# EAGLE design IMU-Measurement-and-Transmission-Module (EAGLE 9.6.2)
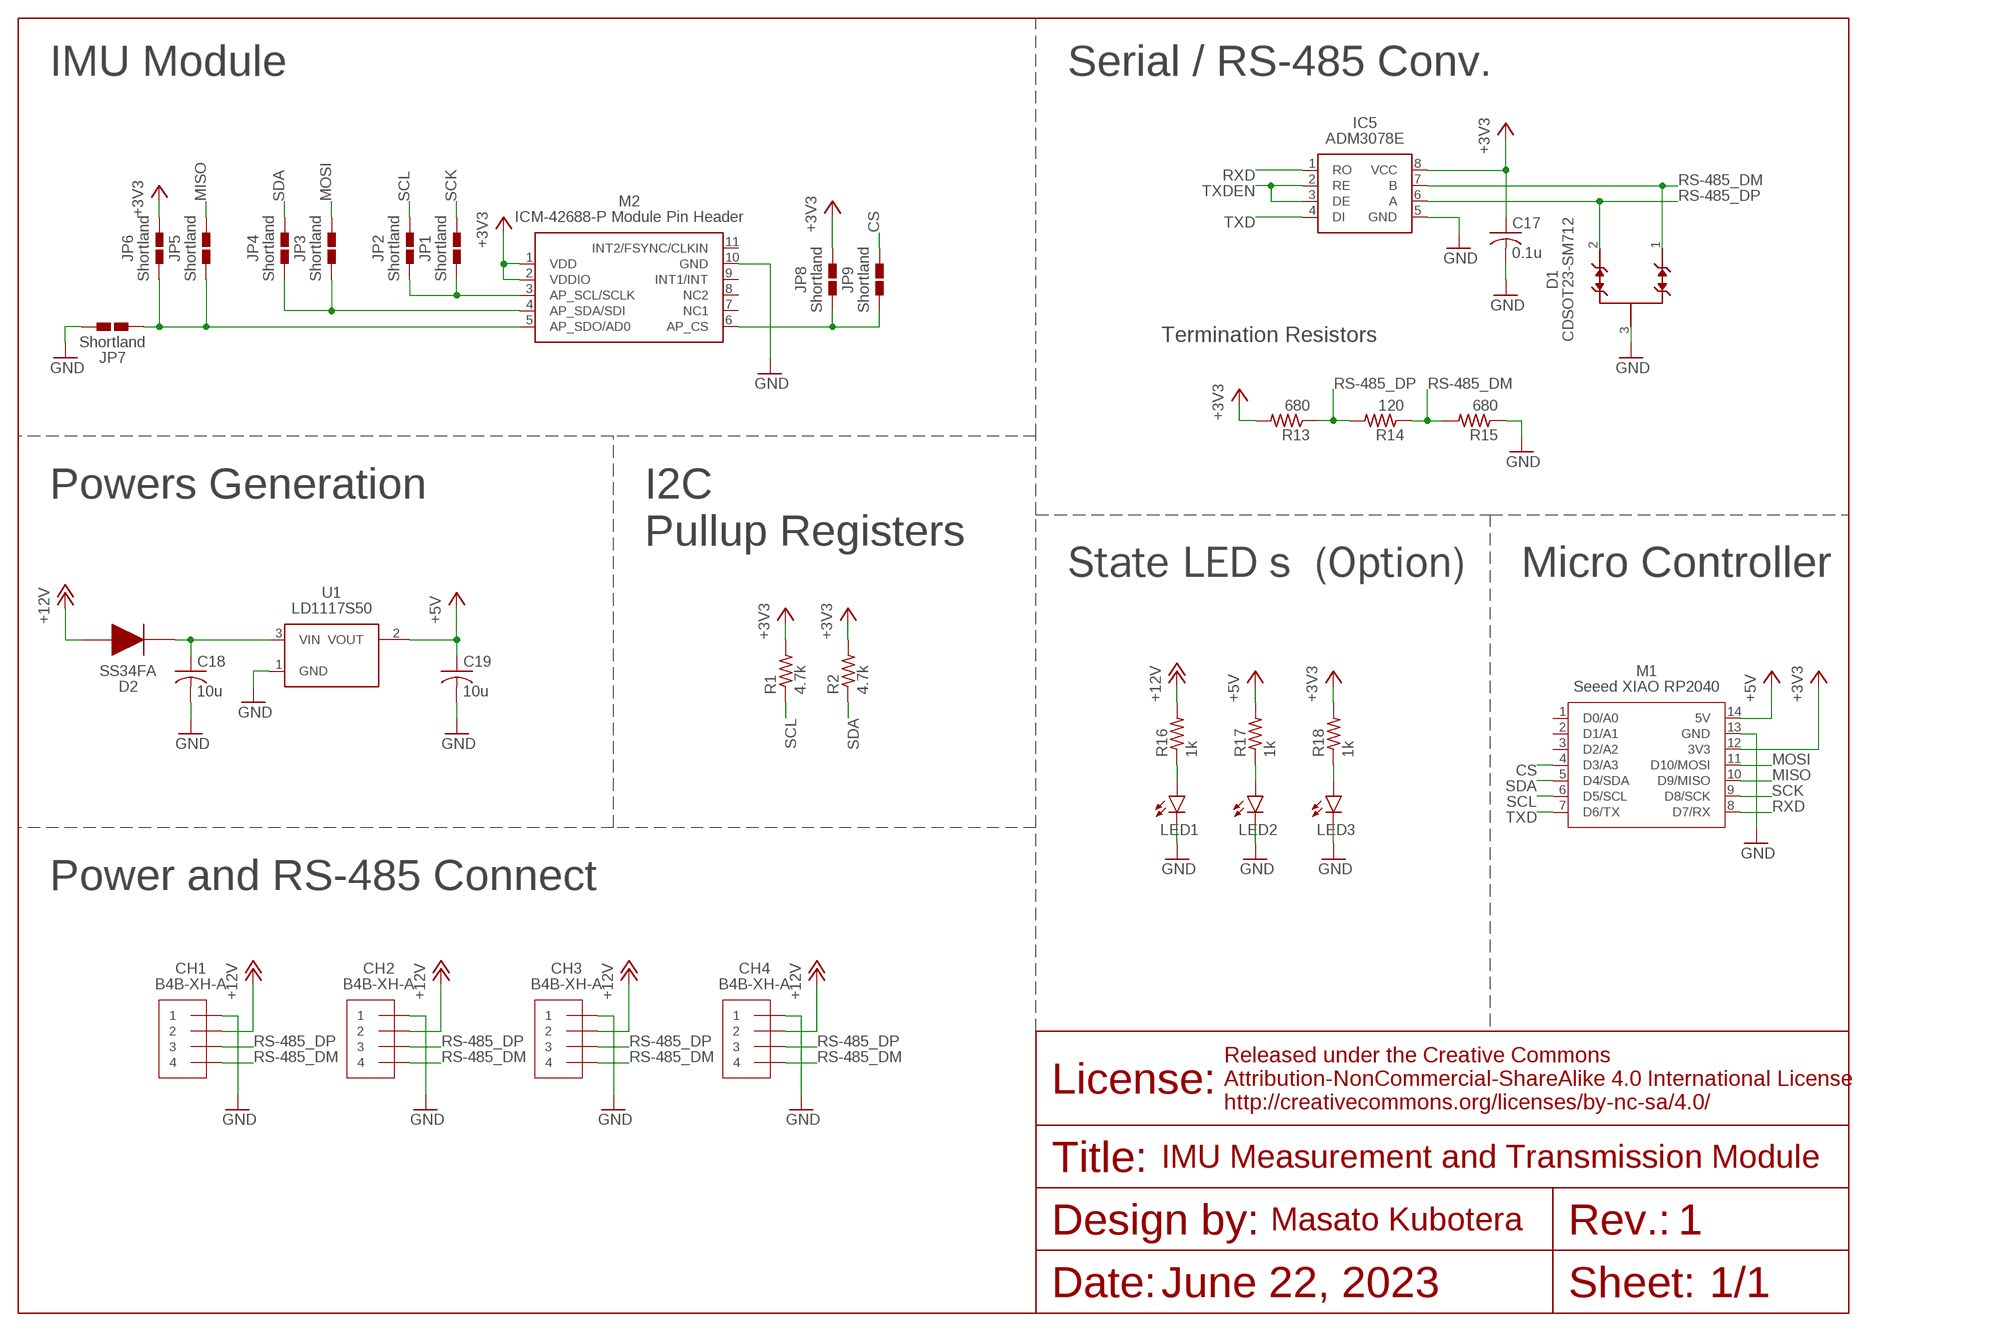
[diagram p0: schematic, sheet 1]

## Parts
C17  0.1u  C-USC0603  [C0603]
C18  10u  C-USC0603  [C0603]
C19  10u  C-USC0603  [C0603]
CH1  B4B-XH-A  [B4B-XH-A]
CH2  B4B-XH-A  [B4B-XH-A]
CH3  B4B-XH-A  [B4B-XH-A]
CH4  B4B-XH-A  [B4B-XH-A]
D1  CDSOT23-SM712  [SOT-23-3]
D2  SS34FA  [SS34FA]
IC5  ADM3078E  [ADM3078E]
JP1  SHORTLAND  [SHORTLAND]
JP2  SHORTLAND  [SHORTLAND]
JP3  SHORTLAND  [SHORTLAND]
JP4  SHORTLAND  [SHORTLAND]
JP5  SHORTLAND  [SHORTLAND]
JP6  SHORTLAND  [SHORTLAND]
JP7  SHORTLAND  [SHORTLAND]
JP8  SHORTLAND  [SHORTLAND]
JP9  SHORTLAND  [SHORTLAND]
LED1  LEDSML0603  [SML0603]
LED2  LEDSML0603  [SML0603]
LED3  LEDSML0603  [SML0603]
M1  SEEED_XIAO_RP2040_HOLE  [SEEED_XIAO_HOLE]
M2  ICM-42688-P-MODULE-PINHEADER  [ICM-42688-P-MODULE-PINHEADER]
R1  4.7k  R-US_R0603  [R0603]
R2  4.7k  R-US_R0603  [R0603]
R13  680  R-US_R0603  [R0603]
R14  120  R-US_R0603  [R0603]
R15  680  R-US_R0603  [R0603]
R16  1k  R-US_R0603  [R0603]
R17  1k  R-US_R0603  [R0603]
R18  1k  R-US_R0603  [R0603]
U1  LD1117S50  [SOT-223]

## Nets
3V3_LED [power]: LED3.A R18.1
5V_LED [power]: LED2.A R17.1
12V_LED [power]: LED1.A R16.1
+3V3 [power]: C17.1 IC5.8(VCC) JP6.2 JP8.2 M1.12(3V3) M2.1(VDD) M2.2(VDDIO) R1.2 R2.2 R13.2 R18.2
+5V [power]: C19.1 M1.14(5V) R17.2 U1.2(VOUT)
+12V [power]: CH1.2 CH2.2 CH3.2 CH4.2 D2.2 R16.2
AP_CS [signal]: JP8.1 JP9.1 M2.6(AP_CS)
AP_SCL/SCLK [signal]: JP1.1 JP2.1 M2.3(AP_SCL/SCLK)
AP_SDA/SDI [signal]: JP3.1 JP4.1 M2.4(AP_SDA/SDI)
AP_SDO/ADO [signal]: JP5.1 JP6.1 JP7.1 M2.5(AP_SDO/AD0)
CS [signal]: JP9.2 M1.4(D3/A3)
GND [power]: C17.2 C18.2 C19.2 CH1.1 CH2.1 CH3.1 CH4.1 D1.3 IC5.5(GND) JP7.2 LED1.C LED2.C LED3.C M1.13(GND) M2.10(GND) R15.1 U1.1(GND)
MISO [signal]: JP5.2 M1.10(D9/MISO)
MOSI [signal]: JP3.2 M1.11(D10/MOSI)
RS-485_DM [power]: CH1.4 CH2.4 CH3.4 CH4.4 D1.1 IC5.7(B) R14.1 R15.2
RS-485_DP [power]: CH1.3 CH2.3 CH3.3 CH4.3 D1.2 IC5.6(A) R13.1 R14.2
RXD [signal]: IC5.1(RO) M1.8(D7/RX)
SCK [signal]: JP1.2 M1.9(D8/SCK)
SCL [signal]: JP2.2 M1.6(D5/SCL) R1.1
SDA [signal]: JP4.2 M1.5(D4/SDA) R2.1
TXD [power]: IC5.4(DI) M1.7(D6/TX)
TXDEN [signal]: IC5.2(RE) IC5.3(DE)
VIN [signal]: C18.1 D2.1 U1.3(VIN)
Unconnected: M1.1(D0/A0) M1.2(D1/A1) M1.3(D2/A2) M2.7(NC1) M2.8(NC2) M2.9(INT1/INT) M2.11(INT2/FSYNC/CLKIN)

## Notes on the sheet
- IMU Module | Serial / RS-485 Conv.
- Termination Resistors
- Powers Generation
- I2C
  Pullup Registers
- State LEDｓ (Option) | Micro Controller
- Power and RS-485 Connect
- IMU Measurement and Transmission Module
- 1
- June 22, 2023 | 1/1

## Library data of the parts
C17-C19 = rcl:C-US: CAPACITOR, American symbol; SPICEPREFIX: C
CH1-CH4 = JST-XH:B4B-XH-A
D1 = CDSOT23-SM712:CDSOT23-SM712
D2 = SS34FA:SS34FA
IC5 = ADM3078E:ADM3078E
JP1-JP9 = Shortland:SHORTLAND
LED1-LED3 = led:LED: LED OSRAM: - CHIPLED LG R971, LG N971, LY N971, LG Q971, LY Q971, LO R971, LY R971 LH N974, LH R974 LS Q976, LO Q976, LY Q976 LO Q996 - Hyper CHIPLED LW Q18S LB Q993, LB Q99A, LB R99A - SideLED LS A670, LO A670, LY A670, LG A670, LP A670 LB A673, LV A673, LT A673, LW A673 LH A674 LY A675 LS A676, LA A676, LO A676, LY A676, LW A676 LS A679, LY A679, LG A679 - Hyper Micro SIDELED® LS Y876, LA Y876, LO Y876, LY Y876 LT Y87S - SmartLED LW L88C, LW L88S LB L89C, LB L89S, LG L890 LS L89K, LO L89K, LY L89K LS L896, LA L896, LO L896, LY L896 - TOPLED LS T670, LO T670, LY T670, LG T670, LP T670 LSG T670, LSP T670, LSY T670, LOP T670, LYG T670 LG T671, LOG T671, LSG T671 LB T673, LV T673, LT T673, LW T673 LH T674 LS T676, LA T676, LO T676, LY T676, LB T676, LH T676, LSB T676, LW T676 LB T67C, LV T67C, LT T67C, LS T67K, LO T67K, LY T67K, LW E67C LS E67B, LA E67B, LO E67B, LY E67B, LB E67C, LV E67C, LT E67C LW T67C LS T679, LY T679, LG T679 LS T770, LO T770, LY T770, LG T770, LP T770 LB T773, LV T773, LT T773, LW T773 LH T774 LS E675, LA E675, LY E675, LS T675 LS T776, LA T776, LO T776, LY T776, LB T776 LHGB T686 LT T68C, LB T68C - Hyper Mini TOPLED® LB M676 - Mini TOPLED Santana® LG M470 LS M47K, LO M47K, LY M47K Source: http://www.osram.convergy.de LUXEON: - LUMILED® LXK2-PW12-R00, LXK2-PW12-S00, LXK2-PW14-U00, LXK2-PW14-V00 LXK2-PM12-R00, LXK2-PM12-S00, LXK2-PM14-U00 LXK2-PE12-Q00, LXK2-PE12-R00, LXK2-PE12-S00, LXK2-PE14-T00, LXK2-PE14-U00 LXK2-PB12-K00, LXK2-PB12-L00, LXK2-PB12-M00, LXK2-PB14-N00, LXK2-PB14-P00, LXK2-PB14-Q00 LXK2-PR12-L00, LXK2-PR12-M00, LXK2-PR14-Q00, LXK2-PR14-R00 LXK2-PD12-Q00, LXK2-PD12-R00, LXK2-PD12-S00 LXK2-PH12-R00, LXK2-PH12-S00 LXK2-PL12-P00, LXK2-PL12-Q00, LXK2-PL12-R00 Source: www.luxeon.com KINGBRIGHT: KA-3528ASYC Source: www.kingbright.com
M1 = Seeed_XIAO:SEEED_XIAO_RP2040_HOLE
M2 = ICM-42688-P-Module:ICM-42688-P-MODULE-PINHEADER
R1 R2 R13-R18 = rcl:R-US_: RESISTOR, American symbol; SPICEPREFIX: R
U1 = LD1117S50:LD1117S50

## Net classes
1 power: width 0.203 mm
2 signal: width 0.203 mm
3 actuator_power: width 1.27 mm

## Board
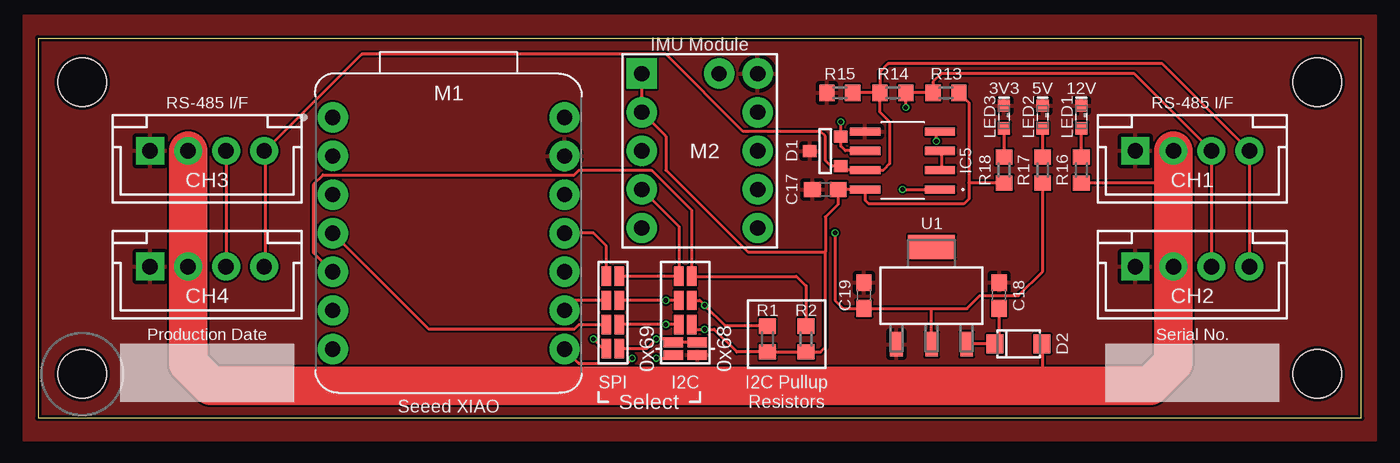
[diagram p1: board, top side]
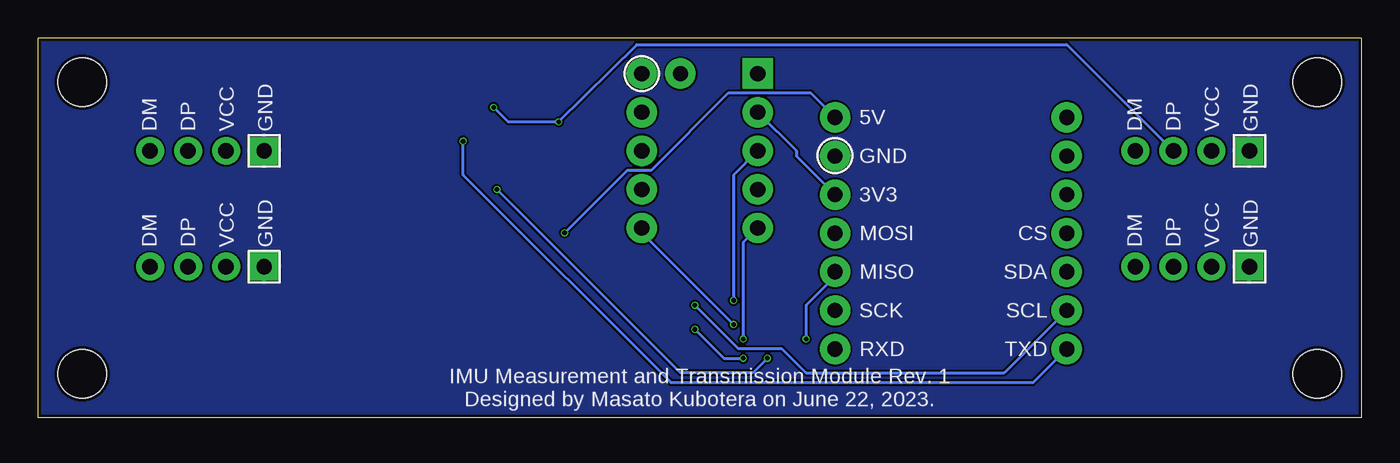
[diagram p2: board, bottom side, seen from below]

Size 87 x 25 mm. Coordinates in mm from the lower left corner, seen from the top.
Outline: 87,0 87,25 0,25 0,0 87,0
Copper layers (1*16): Top 0.035mm / dielectric 1.6mm / Bottom 0.035mm
Design rules "jlcpcb-2layers": minimum track width 5mil, minimum drill 0.3mm, track to track 5mil, track to pad 5mil, pad to pad 5mil, via to via 5mil, smd to smd 5mil, copper to edge 0.2mm, drill to drill 6mil, minimum pad ring 10mil, minimum via ring 3mil, stop-mask expansion 4mil, vias tented up to drill 0mil, thermal gap 10mil
Holes 3.2 mm at 2.9,2.9 84.1,2.9 2.9,22.1 84.1,22.1

### Footprints (pad centres in the part's own frame; a part is rotated, then mirrored left to right if it is on the bottom)
C0603 = smd 1.1 x 1: 1 -0.85,0; 2 0.85,0
B4B-XH-A = drill 1.016 square: 1 -3.75,0 | drill 1.016: 2 -1.25,0; 3 1.25,0; 4 3.75,0
SOT-23-3 = smd 0.787 x 0.889: 1 0.991,1.016; 2 -0.94,1.016; 3 0.025,-1.016
SS34FA = smd 1.12 x 1.22: 1 -1.55,0; 2 1.55,0
ADM3078E = smd 1.981 x 0.533: 1 -2.464,1.905; 2 -2.464,0.635; 3 -2.464,-0.635; 4 -2.464,-1.905; 5 2.464,-1.905; 6 2.464,-0.635; 7 2.464,0.635; 8 2.464,1.905
SHORTLAND = smd 0.635 x 1.27: 1 -0.419,0; 2 0.419,0
SML0603 = smd 0.8 x 0.8: A 0.75,0; C -0.75,0
SEEED_XIAO_HOLE = drill 1 pad 2: 1 -7.62,-2.88; 2 -7.62,-5.42; 3 -7.62,-7.96; 4 -7.62,-10.5; 5 -7.62,-13.04; 6 -7.62,-15.58; 7 -7.62,-18.12; 8 7.62,-18.12; 9 7.62,-15.58; 10 7.62,-13.04; 11 7.62,-10.5; 12 7.62,-7.96; 13 7.62,-5.42; 14 7.62,-2.88
ICM-42688-P-MODULE-PINHEADER = drill 1 pad 2 square: 1 -3.81,5.08 | drill 1 pad 2: 2 -3.81,2.54; 3 -3.81,0; 4 -3.81,-2.54; 5 -3.81,-5.08; 6 3.81,-5.08; 7 3.81,-2.54; 8 3.81,0; 9 3.81,2.54; 10 3.81,5.08; 11 1.27,5.08
R0603 = smd 1 x 1.1: 1 -0.85,0; 2 0.85,0
SOT-223 = smd 1.6 x 0.838: 1 -3.2,2.311; 2 -3.2,0; 3 -3.2,-2.311 | smd 1.6 x 3.099: 4 3.2,0

### Placement (x,y rotation side)
C17  51.76,15.04 180 top
C18  63.19,8.05 90 top
C19  54.3,8.05 90 top
CH1  75.88,17.58 0 top
CH2  75.88,9.96 0 top
CH3  11.12,17.58 0 top
CH4  11.12,9.96 0 top
D1  51.76,17.58 270 top
D2  64.45,4.88 0 top
IC5  56.84,16.95 180 top
JP1  37.78,7.74 180 top
JP2  42.55,7.74 0 top
JP3  37.78,9.32 180 top
JP4  42.55,9.32 0 top
JP5  37.78,4.56 180 top
JP6  41.75,4.56 270 top
JP7  43.34,4.56 270 top
JP8  42.55,6.15 0 top
JP9  37.78,6.15 180 top
LED1  68.58,19.8 270 top
LED2  66.04,19.8 270 top
LED3  63.5,19.8 270 top
M1  26.99,22.66 0 top
M2  43.5,17.58 0 top
R1  47.95,5.2 270 top
R2  50.48,5.2 270 top
R13  59.69,21.39 0 top
R14  56.2,21.39 0 top
R15  52.71,21.39 0 top
R16  68.58,16.31 270 top
R17  66.04,16.31 270 top
R18  63.5,16.31 270 top
U1  58.74,8.05 90 top

### Tracks (layer width: path | path; a pad name or v marks a point on that pad's centre or on a via)
3V3_LED
  Top 0.203: LED3.A R18.1
5V_LED
  Top 0.203: R17.1 LED2.A
12V_LED
  Top 0.203: R16.1 LED1.A
+3V3  (via drill 0.3)
  Top 0.203: M2.1 M2.2 41.28,18.53 41.28,16.31 46.67,10.91 51.76,10.91 | R13.2 61.18,20.76 61.18,15.46 | 61.18,15.46 61.18,14.4 60.86,14.09 54.61,14.09 54.37,14.33 IC5.8 C17.1 52.61,14.09 51.76,13.24 51.76,10.91 | v40.64,3.93 41.59,3.93 JP6.2 | JP8.2 42.87,6.15 43.18,5.83 v43.82,5.83 44.45,5.83 45.94,4.35 R1.2 R2.2 51.44,4.35 51.76,4.67 51.76,10.91 | R18.2 61.18,15.46
  Bottom 0.203: M1.12 37.15,17.24 37.15,17.58 M2.2 | v40.64,3.93 41.91,3.93 v43.82,5.83
+5V  (via drill 0.3)
  Top 0.203: U1.2 58.74,7.21 | 54.3,7.42 C19.1 | v52.39,12.18 52.39,7.74 52.92,7.21 C19.1 | C19.1 58.74,7.21 | 58.74,7.21 61.06,7.21 61.91,8.05 64.45,8.05 66.04,9.64 R17.2
  Bottom 0.203: v52.39,12.18 48.26,16.31 46.67,16.31 41.59,21.39 36.22,21.39 M1.14
+12V
  Top 0.203: 74.64,15.68 74.64,15.46 R16.2 | 66.04,2.11 66.04,4.88 D2.2
  Top 2.54: CH3.2 CH4.2 9.87,3.59 11.34,2.11 66.04,2.11 73.12,2.11 74.64,3.63 CH2.2 74.64,15.68 CH1.2
AP_CS  (via drill 0.3)
  Top 0.203: JP8.1 v41.28,6.15 JP9.1
  Bottom 0.203: M2.6 47.31,12.18 v41.28,6.15
AP_SCL/SCLK  (via drill 0.3)
  Top 0.203: JP2.1 v41.28,7.74 JP1.1
  Bottom 0.203: M2.3 41.28,15.99 v41.28,7.74
AP_SDA/SDI
  Top 0.203: JP3.1 JP4.1 42.13,12.6 M2.4
AP_SDO/ADO  (via drill 0.3)
  Top 0.203: JP7.1 43.18,4.88 43.02,4.98 JP6.1 41.75,5.2 v40.64,5.2 40.01,4.56 JP5.1
  Bottom 0.203: M2.5 40.64,11.55 v40.64,5.2
CS
  Top 0.203: JP9.2 35.56,6.15 35.24,5.83 25.7,5.83 M1.4
GND
  pour Top (rank 2): -0.95,26.47 -0.95,-1.47 87.95,-1.47 87.95,26.47
  pour Bottom (rank 2): -1.59,27.11 -1.59,-2.11 88.59,-2.11 88.59,27.11
MISO  (via drill 0.3)
  Top 0.203: v36.52,5.2 37.15,4.56 JP5.2
  Bottom 0.203: v36.52,5.2 36.52,7.42 34.61,9.32 M1.10
MOSI
  Top 0.203: JP3.2 37.37,11.31 36.52,12.16 M1.11
RS-485_DM
  Top 0.203: CH2.4 CH1.4 73.92,23.3 55.88,23.3 55.35,22.76 R14.1 | 14.93,17.58 14.93,9.96 CH4.4 | R14.1 55.35,20.12 55.98,19.48 55.98,16.73 55.56,16.31 IC5.7 53.02,16.31 D1.1 52.11,16.59 51.76,16.95 51.76,18.53 51.44,18.85 46.36,18.85 41.28,23.93 21.27,23.93 14.93,17.58 | 14.93,17.58 CH3.4 | R14.1 R15.2
RS-485_DP  (via drill 0.3)
  Top 0.203: CH2.3 CH1.3 72.06,22.66 59.38,22.66 58.84,22.13 R13.1 R14.2 v57.05,20.44 | CH3.3 CH4.3 | IC5.6 53.08,17.58 52.77,17.88 D1.2 v52.77,19.48
  Bottom 0.203: v57.05,20.44 56.1,19.48 v52.77,19.48 47.63,24.56 19.37,24.56 12.39,17.58 CH3.3
RXD  (via drill 0.3)
  Top 0.203: v56.84,15.04 IC5.1 | v39.05,3.93 38.74,3.61 35.54,3.61 M1.8
  Bottom 0.203: v56.84,15.04 44.77,2.97 40.01,2.97 v39.05,3.93
SCK
  Top 0.203: JP1.2 35.27,7.74 M1.9
SCL  (via drill 0.3)
  Top 0.203: 43.02,7.58 42.87,7.74 JP2.2 43.5,7.74 v43.82,7.42 45.19,6.05 R1.1
  Bottom 0.203: v43.82,7.42 40.96,4.56 38.1,4.56 36.52,2.97 23.48,2.97 M1.6
SDA
  Top 0.203: R2.1 50.48,8.69 49.85,9.32 JP4.2 42.97,13.67 40.33,16.31 35.56,16.31 35.24,15.99 18.73,15.99 18.1,15.36 18.1,10.89 M1.5
TXD  (via drill 0.3)
  Top 0.203: v59.06,18.21 59.06,18.85 IC5.4
  Bottom 0.203: v59.06,18.21 59.06,15.99 45.41,2.34 21.57,2.34 M1.7
TXDEN
  Top 0.203: IC5.2 59.38,16.31 59.38,17.58 IC5.3
VIN
  Top 0.203: C18.1 63.19,4.88 D2.1 61.28,4.88 U1.3

### Text on the board
tPlace: IMU Module | 3V3 | 5V | 12V | RS-485 I/F | RS-485 I/F | Production Date | Serial No. | 0x69 | 0x68 | SPI | I2C | Select | I2C Pullup / Resistors | Seeed XIAO
bPlace: 5V | GND | VCC | DP | DM | GND | VCC | DP | DM | GND | 3V3 | CS | MOSI | GND | VCC | DP | DM | GND | VCC | DP | DM | SDA | MISO | SCL | SCK | TXD | RXD | IMU Measurement and Transmission Module Rev. 1 / Designed by Masato Kubotera on June 22, 2023.